# Altium schematic sheet Sheet0-mcu.SchDoc
size A4; SheetNumber: 1; SheetTotal: 6
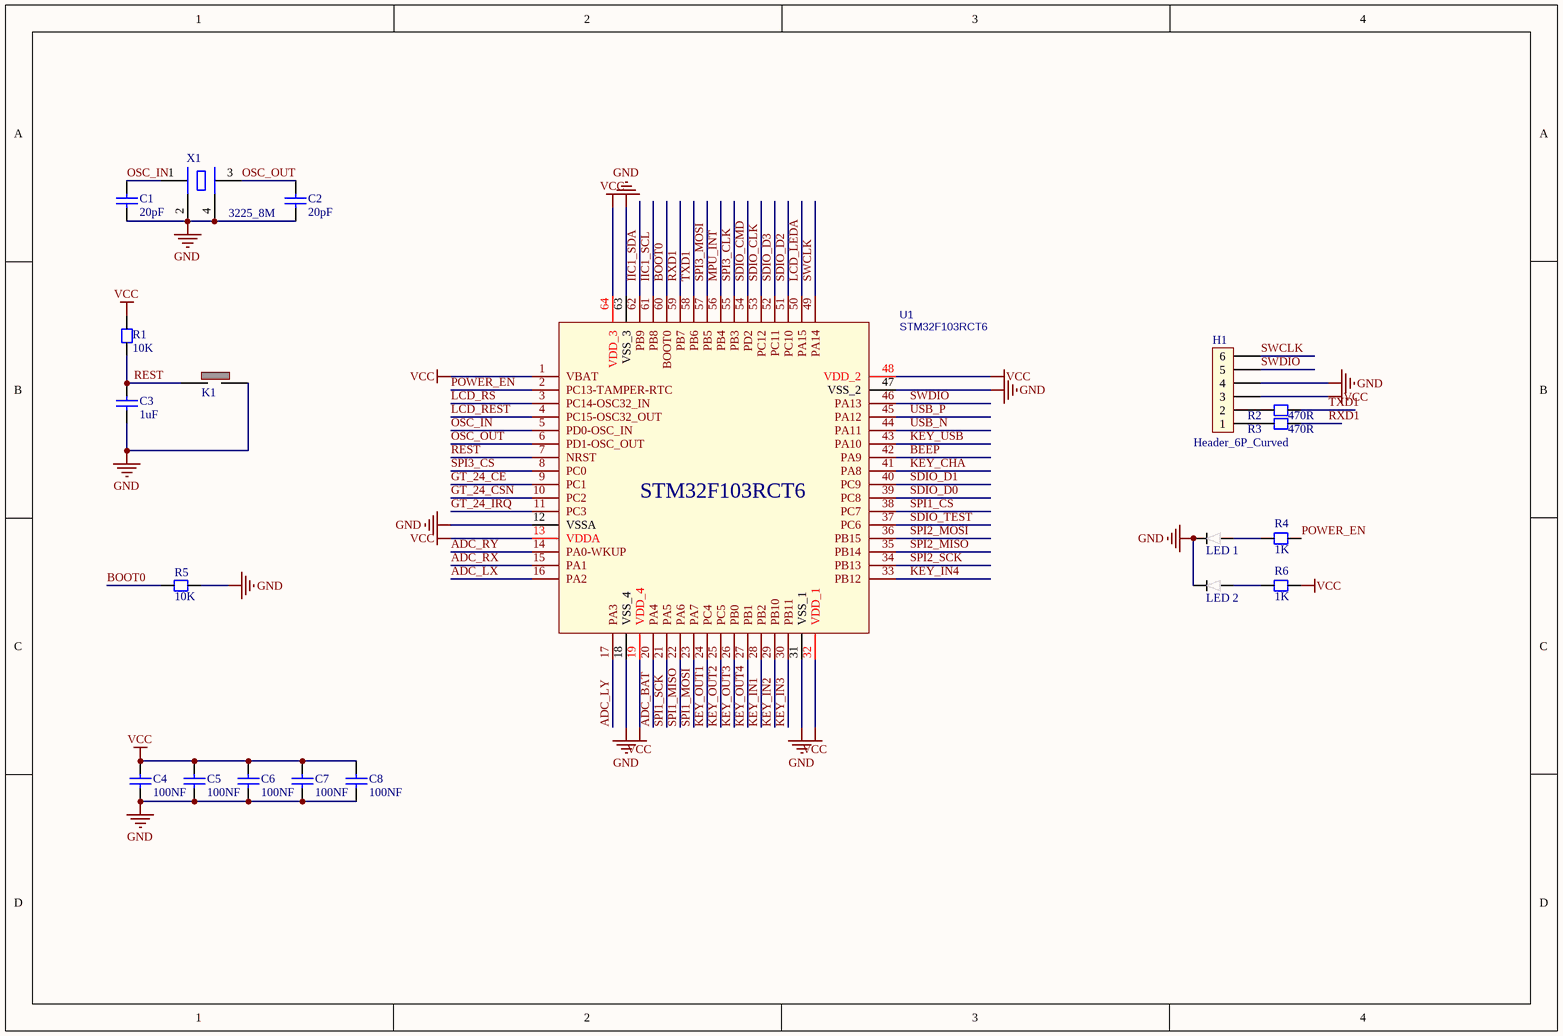
[diagram p0: Sheet0-mcu.SchDoc]

## Parts
C1  20pF  [CC1608-0603]
C2  20pF  [CC1608-0603]
C3  1uF  [CC1608-0603]
C4  100NF  [CC1608-0603]
C5  100NF  [CC1608-0603]
C6  100NF  [CC1608-0603]
C7  100NF  [CC1608-0603]
C8  100NF  [CC1608-0603]
H1  Header_6P_Curved  [Header_2_54_6PW]
K1  KEY 3*4  [KEY 3*4]  (value not drawn)
LED_1  LED 0603  [LED 0603]  (value not drawn)
LED_2  LED 0603  [LED 0603]  (value not drawn)
R1  10K  [CR1608-0603]
R2  470R  [CR1608-0603]
R3  470R  [CR1608-0603]
R4  1K  [CR1608-0603]
R5  10K  [CR1608-0603]
R6  1K  [CR1608-0603]
U1  STM32F103RCT6  [LQFP-64]
X1  3225_8M  [XTAL-3225]

## Nets
GND: C1.1 C2.1 C3.1 C4.1 C5.1 C6.1 C7.1 C8.1 H1.4 K1.2 LED_1.2 LED_2.2 R5.1 U1.12(VSSA) U1.18(VSS_4) U1.31(VSS_1) U1.47(VSS_2) U1.63(VSS_3) X1.2(GND) X1.4(GND)
VCC: C4.2 C5.2 C6.2 C7.2 C8.2 H1.3 R1.2 R6.1 U1.1(VBAT) U1.13(VDDA) U1.19(VDD_4) U1.32(VDD_1) U1.48(VDD_2) U1.64(VDD_3)
ADC_BAT: U1.20(PA4)
ADC_LX: U1.16(PA2)
ADC_LY: U1.17(PA3)
ADC_RX: U1.15(PA1)
ADC_RY: U1.14(PA0-WKUP)
BEEP: U1.42(PA9)
BOOT0: R5.2 U1.60(BOOT0)
GT_24_CE: U1.9(PC1)
GT_24_CSN: U1.10(PC2)
GT_24_IRQ: U1.11(PC3)
IIC1_SCL: U1.61(PB8)
IIC1_SDA: U1.62(PB9)
KEY_CHA: U1.41(PA8)
KEY_IN1: U1.28(PB2)
KEY_IN2: U1.29(PB10)
KEY_IN3: U1.30(PB11)
KEY_IN4: U1.33(PB12)
KEY_OUT1: U1.24(PC4)
KEY_OUT2: U1.25(PC5)
KEY_OUT3: U1.26(PB0)
KEY_OUT4: U1.27(PB1)
KEY_USB: U1.43(PA10)
LCD_LEDA: U1.50(PA15)
LCD_REST: U1.4(PC15-OSC32_OUT)
LCD_RS: U1.3(PC14-OSC32_IN)
MPU_INT: U1.56(PB4)
OSC_IN: C1.2 U1.5(PD0-OSC_IN) X1.1(OSC1)
OSC_OUT: C2.2 U1.6(PD1-OSC_OUT) X1.3(OSC2)
POWER_EN: R4.1 U1.2(PC13-TAMPER-RTC)
REST: C3.2 K1.1 R1.1 U1.7(NRST)
RXD1: R3.1 U1.59(PB7)
SDIO_CLK: U1.53(PC12)
SDIO_CMD: U1.54(PD2)
SDIO_D0: U1.39(PC8)
SDIO_D1: U1.40(PC9)
SDIO_D2: U1.51(PC10)
SDIO_D3: U1.52(PC11)
SDIO_TEST: U1.37(PC6)
SPI1_CS: U1.38(PC7)
SPI1_MISO: U1.22(PA6)
SPI1_MOSI: U1.23(PA7)
SPI1_SCK: U1.21(PA5)
SPI2_MISO: U1.35(PB14)
SPI2_MOSI: U1.36(PB15)
SPI2_SCK: U1.34(PB13)
SPI3_CLK: U1.55(PB3)
SPI3_CS: U1.8(PC0)
SPI3_MOSI: U1.57(PB5)
SWCLK: H1.6 U1.49(PA14)
SWDIO: H1.5 U1.46(PA13)
TXD1: R2.1 U1.58(PB6)
USB_N: U1.44(PA11)
USB_P: U1.45(PA12)
NetH1_1: H1.1 R3.2
NetH1_2: H1.2 R2.2
NetLED_1_1: LED_1.1 R4.2
NetLED_2_1: LED_2.1 R6.2

## Library data of the parts
C1-C8 = Cap Chip 0603: 0603封装的电容; Published: 8-Jun-2000; Revision: July-2002: Re-released for DXP Platform.; Publisher: Altium Limited
H1 = Header_6P_Curved: 弯的6P排针
K1 = KEY 3*4: 轻触开关按键
R1 R4-R6 = Resistor Chip 0603: 0603封装电阻; Published: 8-Jun-2000; Revision: July-2002: Re-released for DXP Platform.; Publisher: Altium Limited
R2 R3 = Chip resistor: 贴片电阻
U1 = STM32F103RCT6: BOM_Manufacturer: ST(意法半导体); BOM_Supplier: LCSC; BOM_Manufacturer Part: STM32F103RCT6; BOM_Supplier Part: C8323; BOM_JLCPCB Part Class: Extended Part; spicePre: U; spiceSymbolName: STM32F103RCT6
X1 = XTAL 3225: 3225封装的晶振